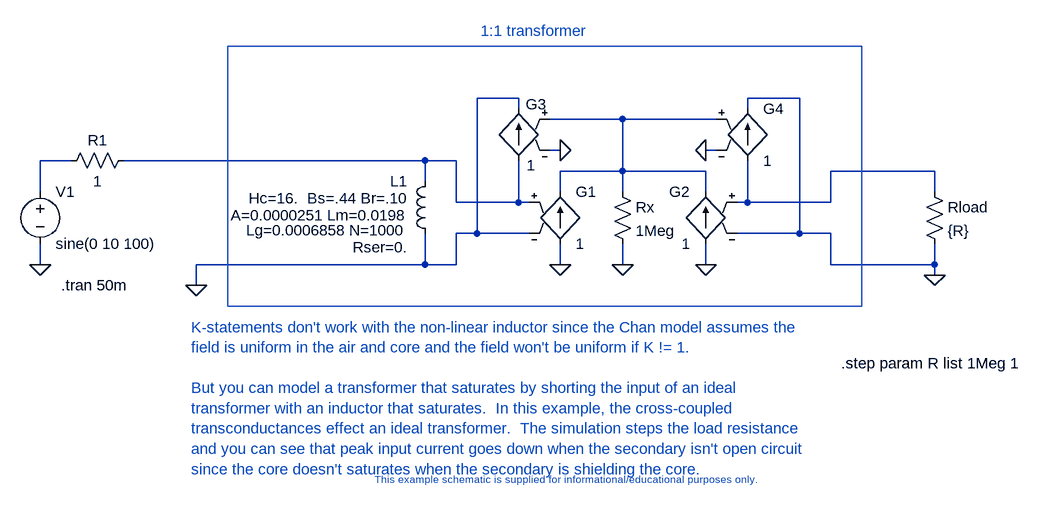
[diagram p0: schematic NonLinearTransformer.asc]
NonLinearTransformer.asc, the LTspice schematic file:
Version 4
SHEET 1 1608 720
WIRE 704 -16 640 -16
WIRE 1136 -16 1056 -16
WIRE 704 0 704 -16
WIRE 1056 0 1056 -16
WIRE 864 16 752 16
WIRE 1008 16 864 16
WIRE 768 64 752 64
WIRE 1008 64 992 64
WIRE 16 80 -32 80
WIRE 560 80 96 80
WIRE 608 80 560 80
WIRE 864 96 864 16
WIRE 864 96 768 96
WIRE 992 96 864 96
WIRE 1344 96 1184 96
WIRE 560 112 560 80
WIRE -32 128 -32 80
WIRE 768 128 768 96
WIRE 864 128 864 96
WIRE 992 128 992 96
WIRE 1344 128 1344 96
WIRE 608 144 608 80
WIRE 704 144 704 80
WIRE 704 144 608 144
WIRE 720 144 704 144
WIRE 1056 144 1056 80
WIRE 1056 144 1040 144
WIRE 1184 144 1184 96
WIRE 1184 144 1056 144
WIRE 640 192 640 -16
WIRE 640 192 608 192
WIRE 720 192 640 192
WIRE 1136 192 1136 -16
WIRE 1136 192 1040 192
WIRE 1184 192 1136 192
WIRE -32 240 -32 208
WIRE 560 240 560 192
WIRE 560 240 208 240
WIRE 608 240 608 192
WIRE 608 240 560 240
WIRE 768 240 768 208
WIRE 864 240 864 208
WIRE 992 240 992 208
WIRE 1184 240 1184 192
WIRE 1344 240 1344 208
WIRE 1344 240 1184 240
WIRE 1344 256 1344 240
WIRE 208 272 208 240
FLAG 208 272 0
FLAG -32 240 0
FLAG 768 64 0
FLAG 864 240 0
FLAG 768 240 0
FLAG 992 240 0
FLAG 992 64 0
FLAG 1344 256 0
SYMBOL ind 576 96 M0
WINDOW 123 41 68 Left 2
WINDOW 39 43 91 Left 2
WINDOW 40 42 117 Left 2
WINDOW 0 43 16 Left 2
WINDOW 3 42 42 Left 2
SYMATTR Value2 A=0.0000251 Lm=0.0198
SYMATTR SpiceLine Lg=0.0006858 N=1000
SYMATTR SpiceLine2 Rser=0.
SYMATTR InstName L1
SYMATTR Value Hc=16.  Bs=.44 Br=.10
SYMBOL voltage -32 112 R0
SYMATTR InstName V1
SYMATTR Value sine(0 10 100)
SYMBOL res 112 64 R90
WINDOW 0 0 56 VBottom 2
WINDOW 3 32 56 VTop 2
SYMATTR InstName R1
SYMATTR Value 1
SYMBOL g 768 112 R0
SYMATTR InstName G1
SYMATTR Value 1
SYMBOL g 992 112 M0
SYMATTR InstName G2
SYMATTR Value 1
SYMBOL g 704 -16 M0
WINDOW 0 -11 9 Right 2
WINDOW 3 -12 103 Right 2
SYMATTR InstName G3
SYMATTR Value 1
SYMBOL g 1056 -16 R0
SYMATTR InstName G4
SYMATTR Value 1
SYMBOL res 848 112 R0
SYMATTR InstName Rx
SYMATTR Value 1Meg
SYMBOL res 1328 112 R0
SYMATTR InstName Rload
SYMATTR Value {R}
TEXT 0 272 Left 2 !.tran 50m
TEXT 1200 392 Left 2 !.step param R list 1Meg 1
TEXT 728 -104 Bottom 2 ;1:1 transformer
TEXT 200 336 Left 2 ;K-statements don't work with the non-linear inductor since the Chan model assumes the\nfield is uniform in the air and core and the field won't be uniform if K != 1.\n \nBut you can model a transformer that saturates by shorting the input of an ideal\ntransformer with an inductor that saturates.  In this example, the cross-coupled\ntransconductances effect an ideal transformer.  The simulation steps the load resistance\nand you can see that peak input current goes down when the secondary isn't open circuit\nsince the core doesn't saturates when the secondary is shielding the core.
TEXT 768 560 Top 1 ;This example schematic is supplied for informational/educational purposes only.
LINE Normal 1232 -96 256 -96
LINE Normal 1232 304 1232 -96
LINE Normal 256 304 1232 304
LINE Normal 256 -96 256 304

The netlist it stands for:
* NonLinearTransformer.asc
L1 N003 0 Hc=16.  Bs=.44 Br=.10 A=0.0000251 Lm=0.0198 Lg=0.0006858 N=1000 Rser=0.
V1 N002 0 sine(0 10 100)
R1 N003 N002 1
G1 0 N001 N003 0 1
G2 0 N001 N004 0 1
G3 N003 0 N001 0 1
G4 N004 0 N001 0 1
Rx N001 0 1Meg
Rload N004 0 {R}
.tran 50m
.step param R list 1Meg 1
* 1:1 transformer
* K-statements don't work with the non-linear inductor since the Chan model assumes the
* field is uniform in the air and core and the field won't be uniform if K != 1.
* But you can model a transformer that saturates by shorting the input of an ideal
* transformer with an inductor that saturates.  In this example, the cross-coupled
* transconductances effect an ideal transformer.  The simulation steps the load resistance
* and you can see that peak input current goes down when the secondary isn't open circuit
* since the core doesn't saturates when the secondary is shielding the core.
* This example schematic is supplied for informational/educational purposes only.
.backanno
.end